# EasyEDA schematic Schematic.json
TITLE: Sheet_1; REV: 1.0; Date: 2026-04-29; Sheet: 1/1; Drawn By: levonnkarapetyan; Company: Your Company
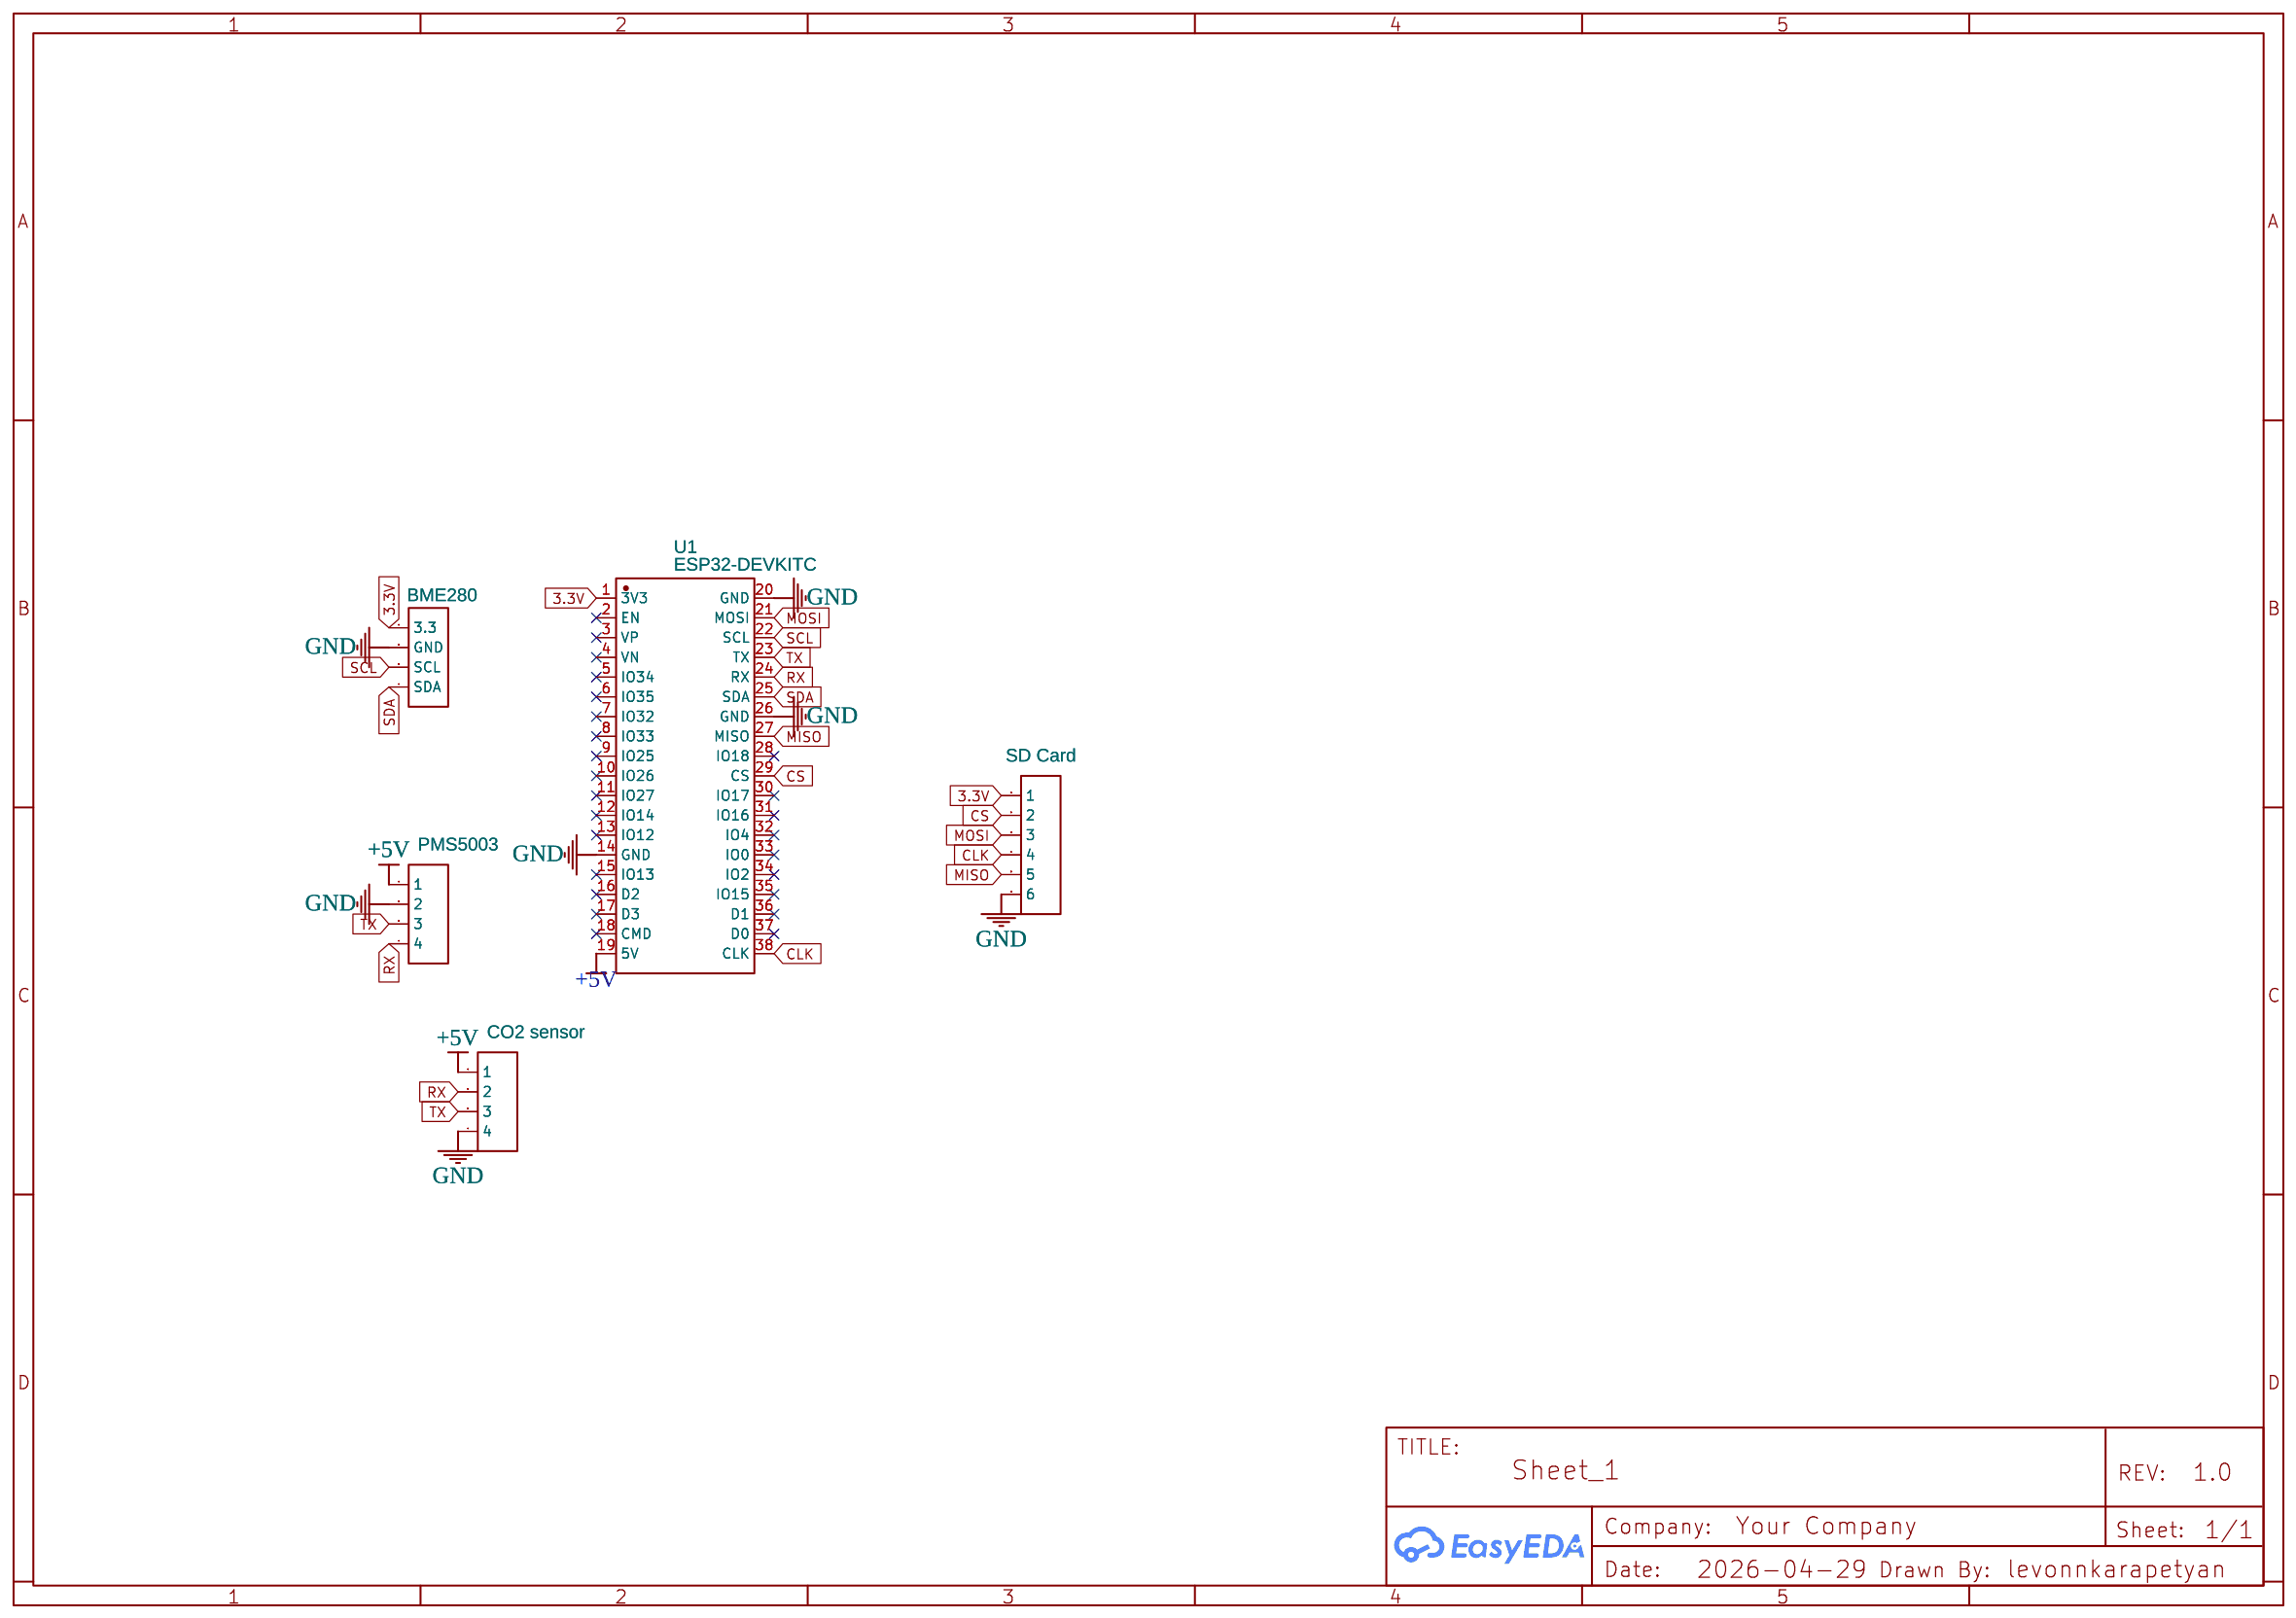
[diagram p0: schematic sheet]

## Parts
J1  PMS5003  [HDR-M-2.54_1X4]
J2  BME280  [HDR-M-2.54_1X4]
J3  CO2 sensor  [HDR-M-2.54_1X4]
J4  SD Card  [HDR-M-2.54_1X6]
U1  ESP32-DEVKITC  [BULETM-SMD_ESP32-DEVKITC]

## Library data of the parts
J1-J3 = HDR-M-2.54_1x4: Supplier Part: C124378; Supplier: LCSC; Contributor: LCEDA_Lib
J4 = HDR-M-2.54_1x6: Supplier Part: C190819; Supplier: LCSC; Contributor: LCEDA_Lib
U1 = ESP32-DEVKITC: Supplier: LCSC; Supplier Part: C571180; Manufacturer: ESPRESSIF(乐鑫); Manufacturer Part: ESP32-DevKitC; Contributor: lcsc

## Nets
3.3V: J2.1(3.3) J4.1 U1.1(3V3)
+5V: J1.1 J3.1 U1.19(5V)
GND: J1.2 J2.2(GND) J3.4 J4.6 U1.14(GND) U1.20(GND) U1.26(GND)
CLK: J4.4 U1.38(CLK)
CS: J4.2 U1.29(CS)
MISO: J4.5 U1.27(MISO)
MOSI: J4.3 U1.21(MOSI)
RX: J1.4 J3.2 U1.24(RX)
SCL: J2.3(SCL) U1.22(SCL)
SDA: J2.4(SDA) U1.25(SDA)
TX: J1.3 J3.3 U1.23(TX)

Not connected (* = marked no-connect by the designer): U1 2(EN)* 3(VP)* 4(VN)* 5(IO34)* 6(IO35)* 7(IO32)* 8(IO33)* 9(IO25)* 10(IO26)* 11(IO27)* 12(IO14)* 13(IO12)* 15(IO13)* 16(D2)* 17(D3)* 18(CMD)* 28(IO18)* 30(IO17)* 31(IO16)* 32(IO4)* 33(IO0)* 34(IO2)* 35(IO15)* 36(D1)* 37(D0)*
